# EasyEDA Pro project 键盘.eprj, board PCB1
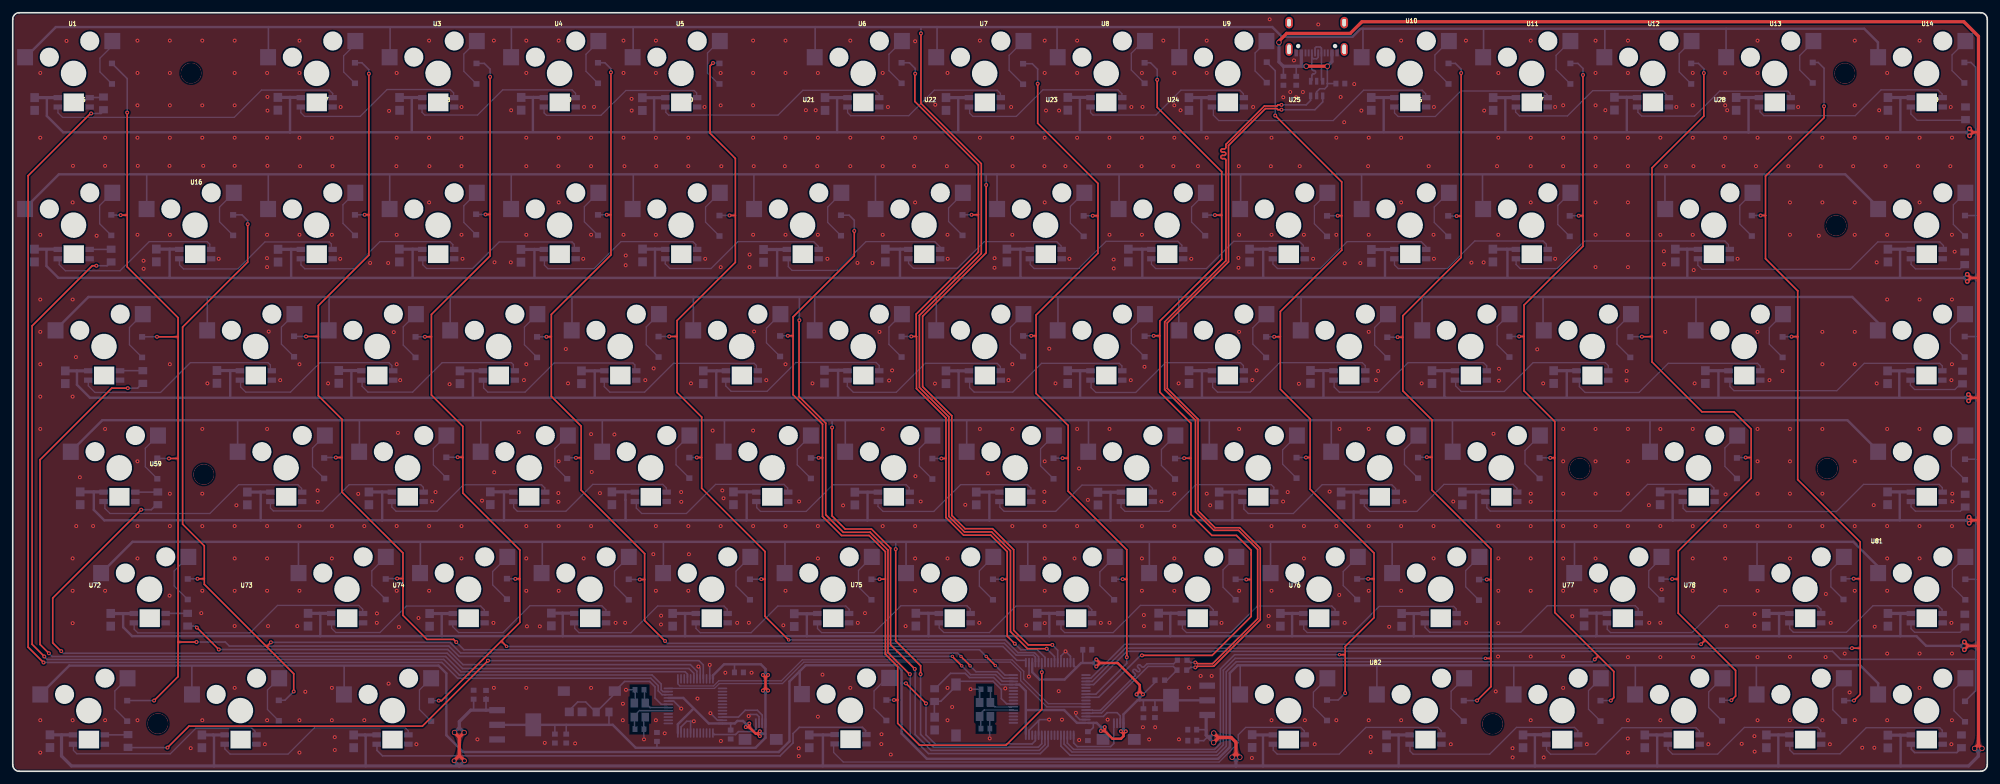
[diagram p3: board, top side]
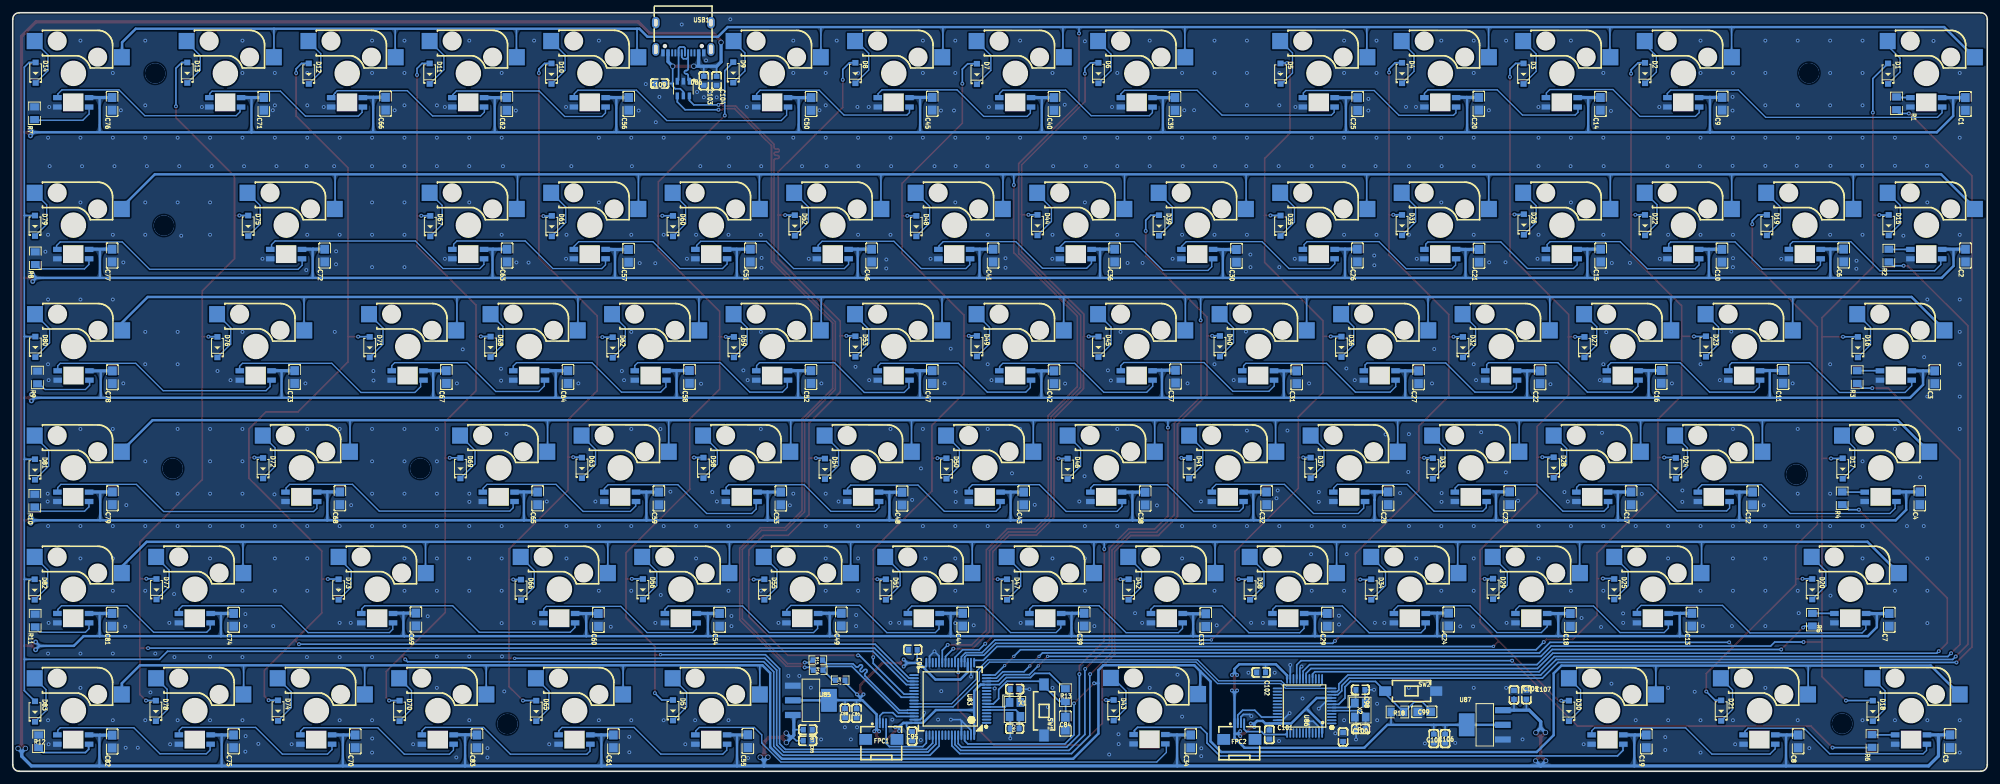
[diagram p4: board, bottom side, seen from below]

Outline 309.56 x 119.06 mm; copper layers: Top Layer, Bottom Layer. Coordinates in mm from the lower left corner of the outline.
Outline path: 0,118.06 0,1 arc(0.29,0.29) 1,0 308.56,0 arc(309.27,0.29) 309.56,1 309.56,118.06 arc(309.27,118.77) 308.56,119.06 1,119.06 arc(0.29,118.77) 0,118.06
Stack: Top Layer 0.035mm / Dielectric1 1.51mm FR4 er 4.5 / Bottom Layer 0.035mm

## Design rules (mm)
net PA11: DP1
net PA12: DP1
net DP_IN: DP2
net DN_OUT: DP3
net DP_OUT: DP3
net DN_IN: DP2
template: 自定义配置
spacing copperThickness1oz (default): track to track 0.102, other pairs 0.152 to 0.3
spacing copperThickness2oz: track to track 0.203, other pairs 0.152 to 0.3
track width copperThickness1oz (default): min 0.127, default 0.254, max 2.54
track width copperThickness2oz: min 0.203, default 0.254, max 2.54
differential pair differentialPair (default): width min 0.127, default 0.254, max 2.54; gap min 0.152, default 0.152
via viaSize (default): diameter min 0.5, default 0.61, max 10; hole min 0.254, default 0.305, max 6.3

## Placement (name value [footprint] x y rotation side)
C1  100nF  [C0805]  3.43 104.74 90 bottom
C2  100nF  [C0805]  3.41 80.95 90 bottom
C3  100nF  [C0805]  8.24 61.85 90 bottom
C4  100nF  [C0805]  10.57 42.85 90 bottom
C5  100nF  [C0805]  5.83 4.72 90 bottom
C6  100nF  [C0805]  22.51 80.96 90 bottom
C7  100nF  [C0805]  15.36 23.77 90 bottom
C8  100nF  [C0805]  29.65 4.7 90 bottom
C9  100nF  [C0805]  41.56 104.77 90 bottom
C10  100nF  [C0805]  41.59 80.93 90 bottom
C11  100nF  [C0805]  32.01 61.9 90 bottom
C12  100nF  [C0805]  36.78 42.82 90 bottom
C13  100nF  [C0805]  46.3 23.79 90 bottom
C14  100nF  [C0805]  60.64 104.76 90 bottom
C15  100nF  [C0805]  60.61 80.95 90 bottom
C16  100nF  [C0805]  51.11 61.9 90 bottom
C17  100nF  [C0805]  55.84 42.84 90 bottom
C18  100nF  [C0805]  65.35 23.76 90 bottom
C19  100nF  [C0805]  53.45 4.7 90 bottom
C20  100nF  [C0805]  79.71 104.77 90 bottom
C21  100nF  [C0805]  79.68 80.91 90 bottom
C22  100nF  [C0805]  70.11 61.85 90 bottom
C23  100nF  [C0805]  74.87 42.86 90 bottom
C24  100nF  [C0805]  84.44 23.82 90 bottom
C25  100nF  [C0805]  98.71 104.72 90 bottom
C26  100nF  [C0805]  98.75 80.96 90 bottom
C27  100nF  [C0805]  89.16 61.85 90 bottom
C28  100nF  [C0805]  93.94 42.85 90 bottom
C29  100nF  [C0805]  103.45 23.77 90 bottom
C30  100nF  [C0805]  117.71 80.9 90 bottom
C31  100nF  [C0805]  108.26 61.85 90 bottom
C32  100nF  [C0805]  112.99 42.85 90 bottom
C33  100nF  [C0805]  122.52 23.72 90 bottom
C34  100nF  [C0805]  124.88 4.7 90 bottom
C35  100nF  [C0805]  127.35 104.74 90 bottom
C36  100nF  [C0805]  136.81 80.95 90 bottom
C37  100nF  [C0805]  127.26 61.95 90 bottom
C38  100nF  [C0805]  132.02 42.81 90 bottom
C39  100nF  [C0805]  141.59 23.8 90 bottom
C40  100nF  [C0805]  146.32 104.74 90 bottom
C41  100nF  [C0805]  155.86 80.95 90 bottom
C42  100nF  [C0805]  146.31 61.85 90 bottom
C43  100nF  [C0805]  151.06 42.82 90 bottom
C44  100nF  [C0805]  160.62 23.79 90 bottom
C45  100nF  [C0805]  165.41 104.77 90 bottom
C46  100nF  [C0805]  174.91 80.95 90 bottom
C47  100nF  [C0805]  165.4 61.88 90 bottom
C48  100nF  [C0805]  170.14 42.8 90 bottom
C49  100nF  [C0805]  179.66 23.81 90 bottom
C50  100nF  [C0805]  184.4 104.74 90 bottom
C51  100nF  [C0805]  193.91 80.95 90 bottom
C52  100nF  [C0805]  184.42 61.88 90 bottom
C53  100nF  [C0805]  189.14 42.82 90 bottom
C54  100nF  [C0805]  198.74 23.77 90 bottom
C55  100nF  [C0805]  194.31 4.73 90 bottom
C56  100nF  [C0805]  212.99 104.76 90 bottom
C57  100nF  [C0805]  213.01 80.9 90 bottom
C58  100nF  [C0805]  203.46 61.9 90 bottom
C59  100nF  [C0805]  208.26 42.82 90 bottom
C60  100nF  [C0805]  217.74 23.76 90 bottom
C61  100nF  [C0805]  215.39 4.7 90 bottom
C62  100nF  [C0805]  232.1 104.74 90 bottom
C63  100nF  [C0805]  232.06 80.95 90 bottom
C64  100nF  [C0805]  222.51 61.88 90 bottom
C65  100nF  [C0805]  227.27 42.84 90 bottom
C66  100nF  [C0805]  251.12 104.79 90 bottom
C67  100nF  [C0805]  241.58 61.88 90 bottom
C68  100nF  [C0805]  258.27 42.85 90 bottom
C69  100nF  [C0805]  246.36 23.82 90 bottom
C70  100nF  [C0805]  255.87 4.7 90 bottom
C71  100nF  [C0805]  270.2 104.76 90 bottom
C72  100nF  [C0805]  260.66 80.95 90 bottom
C73  100nF  [C0805]  265.37 61.88 90 bottom
C74  100nF  [C0805]  274.92 23.77 90 bottom
C75  100nF  [C0805]  274.94 4.7 90 bottom
C76  100nF  [C0805]  293.99 104.76 90 bottom
C77  100nF  [C0805]  293.99 80.95 90 bottom
C78  100nF  [C0805]  293.94 61.85 90 bottom
C79  100nF  [C0805]  293.94 42.85 90 bottom
C81  100nF  [C0805]  293.99 23.77 90 bottom
C82  100nF  [C0805]  293.98 4.67 90 bottom
C83  100nF  [C0805]  236.79 4.7 90 bottom
C84  100nF  [C0805]  144.53 7.48 90 bottom
C85  10uF  [C0603]  184.93 4.8 0 bottom
C86  10uF  [C0603]  177.27 9.11 90 bottom
C87  100nF  [C0603]  184.92 6.53 0 bottom
C88  100nF  [C0603]  179.08 9.13 90 bottom
C93  22pF  [C0603]  152.48 6.71 180 bottom
C94  22pF  [C0603]  152.48 12.9 0 bottom
C95  100nF  [C0603]  168.56 5.51 270 bottom
C96  100nF  [C0603]  168.46 19.07 0 bottom
C97  22pF  [C0603]  98.25 6.63 180 bottom
C98  22pF  [C0603]  98.28 12.78 0 bottom
C99  100nF  [C0805]  88.26 9.32 180 bottom
C100  100nF  [C0603]  101 5.38 90 bottom
C101  100nF  [C0603]  112.55 5.76 270 bottom
C102  100nF  [C0603]  113.85 15.52 0 bottom
C103  10uF  [C0603]  201.23 108.38 90 bottom
C104  100nF  [C0603]  199.22 108.38 90 bottom
C105  10uF  [C0603]  74.2 11.99 270 bottom
C106  10uF  [C0603]  85 5.13 90 bottom
C107  100nF  [C0603]  72.26 12.01 270 bottom
C108  100nF  [C0603]  86.77 5.13 90 bottom
C109  100nF  [C0603]  208.14 107.95 180 bottom
D1  1N4148W  [SOD-123_L2.7-W1.6-LS3.7-FD]  15.55 109.5 270 bottom
D2  1N4148W  [SOD-123_L2.7-W1.6-LS3.7-FD]  53.65 109.6 270 bottom
D3  1N4148W  [SOD-123_L2.7-W1.6-LS3.7-FD]  72.7 109.5 270 bottom
D4  1N4148W  [SOD-123_L2.7-W1.6-LS3.7-FD]  91.75 109.6 270 bottom
D5  1N4148W  [SOD-123_L2.7-W1.6-LS3.7-FD]  110.8 109.5 270 bottom
D6  1N4148W  [SOD-123_L2.7-W1.6-LS3.7-FD]  139.35 109.6 270 bottom
D7  1N4148W  [SOD-123_L2.7-W1.6-LS3.7-FD]  158.4 109.45 270 bottom
D8  1N4148W  [SOD-123_L2.7-W1.6-LS3.7-FD]  177.45 109.6 270 bottom
D9  1N4148W  [SOD-123_L2.7-W1.6-LS3.7-FD]  196.6 109.7 270 bottom
D10  1N4148W  [SOD-123_L2.7-W1.6-LS3.7-FD]  225.1 109.5 270 bottom
D11  1N4148W  [SOD-123_L2.7-W1.6-LS3.7-FD]  244.2 109.5 270 bottom
D12  1N4148W  [SOD-123_L2.7-W1.6-LS3.7-FD]  263.15 109.5 270 bottom
D13  1N4148W  [SOD-123_L2.7-W1.6-LS3.7-FD]  282.2 109.65 270 bottom
D14  1N4148W  [SOD-123_L2.7-W1.6-LS3.7-FD]  305.97 109.65 270 bottom
D15  1N4148W  [SOD-123_L2.7-W1.6-LS3.7-FD]  15.45 85.72 270 bottom
D16  1N4148W  [SOD-123_L2.7-W1.6-LS3.7-FD]  20.28 66.57 270 bottom
D17  1N4148W  [SOD-123_L2.7-W1.6-LS3.7-FD]  22.66 47.52 270 bottom
D18  1N4148W  [SOD-123_L2.7-W1.6-LS3.7-FD]  17.94 9.47 270 bottom
D19  1N4148W  [SOD-123_L2.7-W1.6-LS3.7-FD]  34.55 85.72 270 bottom
D20  1N4148W  [SOD-123_L2.7-W1.6-LS3.7-FD]  27.44 28.57 270 bottom
D21  1N4148W  [SOD-123_L2.7-W1.6-LS3.7-FD]  41.71 9.52 270 bottom
D22  1N4148W  [SOD-123_L2.7-W1.6-LS3.7-FD]  53.65 85.72 270 bottom
D23  1N4148W  [SOD-123_L2.7-W1.6-LS3.7-FD]  44.1 66.67 270 bottom
D24  1N4148W  [SOD-123_L2.7-W1.6-LS3.7-FD]  48.83 47.57 270 bottom
D25  1N4148W  [SOD-123_L2.7-W1.6-LS3.7-FD]  58.48 28.57 270 bottom
D26  1N4148W  [SOD-123_L2.7-W1.6-LS3.7-FD]  72.65 85.83 270 bottom
D27  1N4148W  [SOD-123_L2.7-W1.6-LS3.7-FD]  63.15 66.57 270 bottom
D28  1N4148W  [SOD-123_L2.7-W1.6-LS3.7-FD]  67.98 47.67 270 bottom
D29  1N4148W  [SOD-123_L2.7-W1.6-LS3.7-FD]  77.48 28.62 270 bottom
D30  1N4148W  [SOD-123_L2.7-W1.6-LS3.7-FD]  65.59 9.47 270 bottom
D31  1N4148W  [SOD-123_L2.7-W1.6-LS3.7-FD]  91.75 85.72 270 bottom
D32  1N4148W  [SOD-123_L2.7-W1.6-LS3.7-FD]  82.2 66.57 270 bottom
D33  1N4148W  [SOD-123_L2.7-W1.6-LS3.7-FD]  86.93 47.52 270 bottom
D34  1N4148W  [SOD-123_L2.7-W1.6-LS3.7-FD]  96.58 28.52 270 bottom
D35  1N4148W  [SOD-123_L2.7-W1.6-LS3.7-FD]  110.8 85.62 270 bottom
D36  1N4148W  [SOD-123_L2.7-W1.6-LS3.7-FD]  101.25 66.62 270 bottom
D37  1N4148W  [SOD-123_L2.7-W1.6-LS3.7-FD]  106.08 47.62 270 bottom
D38  1N4148W  [SOD-123_L2.7-W1.6-LS3.7-FD]  115.58 28.52 270 bottom
D39  1N4148W  [SOD-123_L2.7-W1.6-LS3.7-FD]  129.85 85.67 270 bottom
D40  1N4148W  [SOD-123_L2.7-W1.6-LS3.7-FD]  120.3 66.72 270 bottom
D41  1N4148W  [SOD-123_L2.7-W1.6-LS3.7-FD]  125.13 47.57 270 bottom
D42  1N4148W  [SOD-123_L2.7-W1.6-LS3.7-FD]  134.63 28.52 270 bottom
D43  1N4148W  [SOD-123_L2.7-W1.6-LS3.7-FD]  136.96 9.57 270 bottom
D44  1N4148W  [SOD-123_L2.7-W1.6-LS3.7-FD]  148.9 85.72 270 bottom
D45  1N4148W  [SOD-123_L2.7-W1.6-LS3.7-FD]  139.35 66.62 270 bottom
D46  1N4148W  [SOD-123_L2.7-W1.6-LS3.7-FD]  144.18 47.47 270 bottom
D47  1N4148W  [SOD-123_L2.7-W1.6-LS3.7-FD]  153.68 28.52 270 bottom
D48  1N4148W  [SOD-123_L2.7-W1.6-LS3.7-FD]  167.9 85.57 270 bottom
D49  1N4148W  [SOD-123_L2.7-W1.6-LS3.7-FD]  158.4 66.72 270 bottom
D50  1N4148W  [SOD-123_L2.7-W1.6-LS3.7-FD]  163.18 47.52 270 bottom
D51  1N4148W  [SOD-123_L2.7-W1.6-LS3.7-FD]  172.68 28.52 270 bottom
D52  1N4148W  [SOD-123_L2.7-W1.6-LS3.7-FD]  186.95 85.67 270 bottom
D53  1N4148W  [SOD-123_L2.7-W1.6-LS3.7-FD]  177.45 66.67 270 bottom
D54  1N4148W  [SOD-123_L2.7-W1.6-LS3.7-FD]  182.23 47.47 270 bottom
D55  1N4148W  [SOD-123_L2.7-W1.6-LS3.7-FD]  191.73 28.52 270 bottom
D56  1N4148W  [SOD-123_L2.7-W1.6-LS3.7-FD]  210.78 28.57 270 bottom
D57  1N4148W  [SOD-123_L2.7-W1.6-LS3.7-FD]  206.05 9.57 270 bottom
D58  1N4148W  [SOD-123_L2.7-W1.6-LS3.7-FD]  201.28 47.62 270 bottom
D59  1N4148W  [SOD-123_L2.7-W1.6-LS3.7-FD]  196.5 66.57 270 bottom
D60  1N4148W  [SOD-123_L2.7-W1.6-LS3.7-FD]  206.05 85.57 270 bottom
D61  1N4148W  [SOD-123_L2.7-W1.6-LS3.7-FD]  225.05 85.57 270 bottom
D62  1N4148W  [SOD-123_L2.7-W1.6-LS3.7-FD]  215.5 66.52 270 bottom
D63  1N4148W  [SOD-123_L2.7-W1.6-LS3.7-FD]  220.33 47.62 270 bottom
D65  1N4148W  [SOD-123_L2.7-W1.6-LS3.7-FD]  227.49 9.47 270 bottom
D66  1N4148W  [SOD-123_L2.7-W1.6-LS3.7-FD]  229.88 28.47 270 bottom
D67  1N4148W  [SOD-123_L2.7-W1.6-LS3.7-FD]  244.1 85.57 270 bottom
D68  1N4148W  [SOD-123_L2.7-W1.6-LS3.7-FD]  234.65 66.62 270 bottom
D69  1N4148W  [SOD-123_L2.7-W1.6-LS3.7-FD]  239.38 47.57 270 bottom
D70  1N4148W  [SOD-123_L2.7-W1.6-LS3.7-FD]  248.93 9.47 270 bottom
D71  1N4148W  [SOD-123_L2.7-W1.6-LS3.7-FD]  253.6 66.57 270 bottom
D72  1N4148W  [SOD-123_L2.7-W1.6-LS3.7-FD]  270.31 47.57 270 bottom
D73  1N4148W  [SOD-123_L2.7-W1.6-LS3.7-FD]  258.48 28.52 270 bottom
D74  1N4148W  [SOD-123_L2.7-W1.6-LS3.7-FD]  267.98 9.52 270 bottom
D75  1N4148W  [SOD-123_L2.7-W1.6-LS3.7-FD]  272.65 85.62 270 bottom
D76  1N4148W  [SOD-123_L2.7-W1.6-LS3.7-FD]  277.48 66.57 270 bottom
D77  1N4148W  [SOD-123_L2.7-W1.6-LS3.7-FD]  287.03 28.57 270 bottom
D78  1N4148W  [SOD-123_L2.7-W1.6-LS3.7-FD]  287.13 9.47 270 bottom
D79  1N4148W  [SOD-123_L2.7-W1.6-LS3.7-FD]  306.08 85.62 270 bottom
D80  1N4148W  [SOD-123_L2.7-W1.6-LS3.7-FD]  306.03 66.62 270 bottom
D81  1N4148W  [SOD-123_L2.7-W1.6-LS3.7-FD]  306.08 47.37 270 bottom
D82  1N4148W  [SOD-123_L2.7-W1.6-LS3.7-FD]  306.13 28.52 270 bottom
D83  1N4148W  [SOD-123_L2.7-W1.6-LS3.7-FD]  306.08 9.37 270 bottom
D86  USBLC6-2SC6  [SOT-23-6_L2.9-W1.6-P0.95-LS2.8-BL]  204.43 107.16 0 bottom
FPC1  XW05202-040R-00  [FPC-SMD_4P-P0.50_HCTL_XW05202-040R-00]  173.39 6.27 180 bottom
FPC2  XW05202-040R-00  [FPC-SMD_4P-P0.50_HCTL_XW05202-040R-00]  117.25 6.27 180 bottom
R1  500Ω  [R0805]  14.22 104.84 90 bottom
R2  500Ω  [R0805]  15.43 80.94 90 bottom
R3  500Ω  [R0805]  20.39 61.88 90 bottom
R4  500Ω  [R0805]  22.74 42.84 90 bottom
R5  500Ω  [R0805]  27.41 23.79 90 bottom
R6  500Ω  [R0805]  18.07 4.75 90 bottom
R7  500Ω  [R0805]  306.15 103.28 90 bottom
R8  500Ω  [R0805]  306.03 80.52 90 bottom
R9  500Ω  [R0805]  305.69 61.81 90 bottom
R10  500Ω  [R0805]  306.11 42.48 90 bottom
R11  500Ω  [R0805]  306.05 23.65 90 bottom
R12  500Ω  [R0805]  305.52 4.7 90 bottom
R13  10kΩ  [R0805]  144.53 11.95 90 bottom
R15  22Ω  [R0603]  183.34 17.45 180 bottom
R16  22Ω  [R0603]  183.29 15.87 180 bottom
R17  1.5kΩ  [R0603]  179.84 14.3 180 bottom
R18  10kΩ  [R0805]  92.47 9.3 0 bottom
SW1  TS-1101-C-W  [SW-SMD_L6.0-W3.3-LS8.0]  147.88 9.62 90 bottom
SW2  TS-1101-C-W  [SW-SMD_L6.0-W3.3-LS8.0]  90.4 12.58 0 bottom
U1  -  [凯华rgb轴座5脚]  9.56 109.55 0 top
U2  -  [凯华rgb轴座5脚]  47.66 109.55 0 top
U3  -  [凯华rgb轴座5脚]  66.71 109.55 0 top
U4  -  [凯华rgb轴座5脚]  85.76 109.55 0 top
U5  -  [凯华rgb轴座5脚]  104.81 109.55 0 top
U6  -  [凯华rgb轴座5脚]  133.36 109.55 0 top
U7  -  [凯华rgb轴座5脚]  152.41 109.55 0 top
U8  -  [凯华rgb轴座5脚]  171.46 109.55 0 top
U9  -  [凯华rgb轴座5脚]  190.51 109.55 0 top
U10  -  [凯华rgb轴座5脚]  219.11 109.55 0 top
U11  -  [凯华rgb轴座5脚]  238.16 109.55 0 top
U12  -  [凯华rgb轴座5脚]  257.16 109.55 0 top
U13  -  [凯华rgb轴座5脚]  276.26 109.55 0 top
U14  -  [凯华rgb轴座5脚]  300.08 109.55 0 top
U15  -  [凯华rgb轴座5脚]  9.56 85.72 0 top
U16  -  [凯华rgb轴座5脚]  28.61 85.72 0 top
U17  -  [凯华rgb轴座5脚]  47.66 85.72 0 top
U18  -  [凯华rgb轴座5脚]  66.71 85.72 0 top
U19  -  [凯华rgb轴座5脚]  85.76 85.72 0 top
U20  -  [凯华rgb轴座5脚]  104.81 85.72 0 top
U21  -  [凯华rgb轴座5脚]  123.86 85.72 0 top
U22  -  [凯华rgb轴座5脚]  142.91 85.72 0 top
U23  -  [凯华rgb轴座5脚]  161.96 85.72 0 top
U24  -  [凯华rgb轴座5脚]  181.01 85.72 0 top
U25  -  [凯华rgb轴座5脚]  200.06 85.72 0 top
U26  -  [凯华rgb轴座5脚]  219.11 85.72 0 top
U27  -  [凯华rgb轴座5脚]  238.16 85.72 0 top
U28  -  [凯华rgb轴座5脚]  266.71 85.72 0 top
U29  -  [凯华rgb轴座5脚]  300.08 85.72 0 top
U30  -  [凯华rgb轴座5脚]  14.33 66.67 0 top
U31  -  [凯华rgb轴座5脚]  38.11 66.67 0 top
U32  -  [凯华rgb轴座5脚]  57.16 66.67 0 top
U33  -  [凯华rgb轴座5脚]  76.21 66.67 0 top
U34  -  [凯华rgb轴座5脚]  95.26 66.67 0 top
U35  -  [凯华rgb轴座5脚]  114.31 66.67 0 top
U36  -  [凯华rgb轴座5脚]  133.36 66.67 0 top
U37  -  [凯华rgb轴座5脚]  152.41 66.67 0 top
U38  -  [凯华rgb轴座5脚]  171.46 66.67 0 top
U39  -  [凯华rgb轴座5脚]  190.51 66.67 0 top
U40  -  [凯华rgb轴座5脚]  209.56 66.67 0 top
U41  -  [凯华rgb轴座5脚]  228.61 66.67 0 top
U42  -  [凯华rgb轴座5脚]  247.66 66.67 0 top
U43  -  [凯华rgb轴座5脚]  271.48 66.67 0 top
U44  -  [凯华rgb轴座5脚]  300.03 66.67 0 top
U45  -  [凯华rgb轴座5脚]  16.72 47.62 0 top
U46  -  [凯华rgb轴座5脚]  42.88 47.62 0 top
U47  -  [凯华rgb轴座5脚]  61.93 47.62 0 top
U48  -  [凯华rgb轴座5脚]  80.98 47.62 0 top
U49  -  [凯华rgb轴座5脚]  100.03 47.62 0 top
U50  -  [凯华rgb轴座5脚]  119.08 47.62 0 top
U51  -  [凯华rgb轴座5脚]  138.13 47.62 0 top
U52  -  [凯华rgb轴座5脚]  157.18 47.62 0 top
U53  -  [凯华rgb轴座5脚]  176.23 47.62 0 top
U54  -  [凯华rgb轴座5脚]  195.28 47.62 0 top
U55  -  [凯华rgb轴座5脚]  214.33 47.62 0 top
U56  -  [凯华rgb轴座5脚]  233.38 47.62 0 top
U57  -  [凯华rgb轴座5脚]  264.32 47.62 0 top
U58  -  [凯华rgb轴座5脚]  300.08 47.62 0 top
U59  -  [凯华rgb轴座5脚]  21.48 28.58 0 top
U60  -  [凯华rgb轴座5脚]  52.43 28.57 0 top
U61  -  [凯华rgb轴座5脚]  71.48 28.57 0 top
U62  -  [凯华rgb轴座5脚]  90.53 28.57 0 top
U63  -  [凯华rgb轴座5脚]  109.58 28.57 0 top
U64  -  [凯华rgb轴座5脚]  128.63 28.57 0 top
U65  -  [凯华rgb轴座5脚]  147.68 28.57 0 top
U66  -  [凯华rgb轴座5脚]  166.73 28.57 0 top
U67  -  [凯华rgb轴座5脚]  185.78 28.57 0 top
U68  -  [凯华rgb轴座5脚]  204.83 28.57 0 top
U69  -  [凯华rgb轴座5脚]  223.88 28.57 0 top
U70  -  [凯华rgb轴座5脚]  252.43 28.57 0 top
U71  -  [凯华rgb轴座5脚]  281.03 28.57 0 top
U72  -  [凯华rgb轴座5脚]  11.94 9.52 0 top
U73  -  [凯华rgb轴座5脚]  35.72 9.52 0 top
U74  -  [凯华rgb轴座5脚]  59.54 9.52 0 top
U75  -  [凯华rgb轴座5脚]  131.35 9.57 0 top
U76  -  [凯华rgb轴座5脚]  200.06 9.52 0 top
U77  -  [凯华rgb轴座5脚]  242.93 9.52 0 top
U78  -  [凯华rgb轴座5脚]  261.98 9.52 0 top
U79  -  [凯华rgb轴座5脚]  281.03 9.52 0 top
U80  -  [凯华rgb轴座5脚]  300.08 9.52 0 top
U81  -  [凯华rgb轴座5脚]  300.08 28.57 0 top
U82  -  [凯华rgb轴座5脚]  221.49 9.52 0 top
U83  STM32F103RCT6  [LQFP-64_L10.0-W10.0-P0.50-LS12.0-BL]  162.57 11.35 90 bottom
U85  AMS1117-3.3  [SOT-223-4_L6.5-W3.5-P2.30-LS7.0-BR]  184.43 11.13 0 bottom
U86  STM32F103C8T6  [LQFP-48_L7.0-W7.0-P0.50-LS9.0-BL]  107.03 10.26 90 bottom
U87  AMS1117-3.3  [SOT-223-4_L6.5-W3.5-P2.30-LS7.0-BR]  78.77 7.29 180 bottom
USB1  TYPE-C 16PIN 2MD(073)  [USB-C-SMD_TYPE-C-6PIN-2MD-073]  204.43 115.14 0 bottom
X1  8MHz  [CRYSTAL-SMD_4P-L3.2-W2.5-BL]  152.43 9.7 270 bottom
X2  8MHz  [CRYSTAL-SMD_4P-L3.2-W2.5-BL]  98.3 9.6 270 bottom

## Footprints (pads in the part's own frame, mm; a bottom-side part is the same pattern mirrored in y, then rotated)
C0603
  rect 0.8x0.9 smd: 1(-0.7,0) 2(0.7,0)
C0805
  rect 1.41x1.35 smd: 1(-1,0) 2(1,0)
CRYSTAL-SMD_4P-L3.2-W2.5-BL
  rect 1.4x1.2 smd: 1(-1.1,-0.85) 2(1.1,-0.85) 3(1.1,0.85) 4(-1.1,0.85)
FPC-SMD_4P-P0.50_HCTL_XW05202-040R-00
  rect 0.3x1.5 smd: 1(-0.75,1.275) 2(-0.25,1.275) 3(0.25,1.275) 4(0.75,1.275)
  rect 2x1.7 smd: 5(2.45,-1.275) 6(-2.45,-1.275)
LQFP-48_L7.0-W7.0-P0.50-LS9.0-BL
  oval 0.27x1.5 smd: 1(-2.75,-4.25) 2(-2.25,-4.25) 3(-1.75,-4.25) 4(-1.25,-4.25) 5(-0.75,-4.25) 6(-0.25,-4.25) 7(0.25,-4.25) 8(0.75,-4.25) 9(1.25,-4.25) 10(1.75,-4.25) 11(2.25,-4.25) 12(2.75,-4.25) 25(2.75,4.25) 26(2.25,4.25) 27(1.75,4.25) 28(1.25,4.25) 29(0.75,4.25) 30(0.25,4.25) 31(-0.25,4.25) 32(-0.75,4.25) 33(-1.25,4.25) 34(-1.75,4.25) 35(-2.25,4.25) 36(-2.75,4.25)
  oval 1.5x0.27 smd: 13(4.25,-2.75) 14(4.25,-2.25) 15(4.25,-1.75) 16(4.25,-1.25) 17(4.25,-0.75) 18(4.25,-0.25) 19(4.25,0.25) 20(4.25,0.75) 21(4.25,1.25) 22(4.25,1.75) 23(4.25,2.25) 24(4.25,2.75) 37(-4.25,2.75) 38(-4.25,2.25) 39(-4.25,1.75) 40(-4.25,1.25) 41(-4.25,0.75) 42(-4.25,0.25) 43(-4.25,-0.25) 44(-4.25,-0.75) 45(-4.25,-1.25) 46(-4.25,-1.75) 47(-4.25,-2.25) 48(-4.25,-2.75)
LQFP-64_L10.0-W10.0-P0.50-LS12.0-BL
  oval 0.3x1.5 smd: 1(-3.75,-5.688) 2(-3.25,-5.688) 3(-2.75,-5.688) 4(-2.25,-5.688) 5(-1.75,-5.688) 6(-1.25,-5.688) 7(-0.75,-5.688) 8(-0.25,-5.688) 9(0.25,-5.688) 10(0.75,-5.688) 11(1.25,-5.688) 12(1.75,-5.688) 13(2.25,-5.688) 14(2.75,-5.688) 15(3.25,-5.688) 16(3.75,-5.688) 33(3.75,5.688) 34(3.25,5.688) 35(2.75,5.688) 36(2.25,5.688) 37(1.75,5.688) 38(1.25,5.688) 39(0.75,5.688) 40(0.25,5.688) 41(-0.25,5.688) 42(-0.75,5.688) 43(-1.25,5.688) 44(-1.75,5.688) 45(-2.25,5.688) 46(-2.75,5.688) 47(-3.25,5.688) 48(-3.75,5.688)
  oval 1.5x0.3 smd: 17(5.7,-3.738) 18(5.7,-3.238) 19(5.7,-2.738) 20(5.7,-2.238) 21(5.7,-1.738) 22(5.7,-1.238) 23(5.7,-0.739) 24(5.7,-0.238) 25(5.7,0.262) 26(5.7,0.762) 27(5.7,1.262) 28(5.7,1.762) 29(5.7,2.261) 30(5.7,2.762) 31(5.7,3.261) 32(5.7,3.762) 49(-5.7,3.762) 50(-5.7,3.261) 51(-5.7,2.762) 52(-5.7,2.261) 53(-5.7,1.762) 54(-5.7,1.262) 55(-5.7,0.762) 56(-5.7,0.262) 57(-5.7,-0.238) 58(-5.7,-0.739) 59(-5.7,-1.238) 60(-5.7,-1.738) 61(-5.7,-2.238) 62(-5.7,-2.738) 63(-5.7,-3.238) 64(-5.7,-3.738)
R0603
  rect 0.806x0.864 smd: 1(-0.753,0) 2(0.753,0)
R0805
  rect 1.133x1.377 smd: 1(-1,0) 2(1,0)
SOD-123_L2.7-W1.6-LS3.7-FD
  rect 0.88x0.96 smd: 1(-1.61,0) 2(1.61,0)
SOT-23-6_L2.9-W1.6-P0.95-LS2.8-BL
  rect 0.532x1.072 smd: 1(-0.95,-1.149) 2(0,-1.149) 3(0.95,-1.149) 4(0.95,1.149) 5(0,1.149) 6(-0.95,1.149)
SOT-223-4_L6.5-W3.5-P2.30-LS7.0-BR
  rect 2.47x0.98 smd: 1(2.835,-2.3) 2(2.835,0) 3(2.835,2.3)
  rect 2.47x3.6 smd: 4(-2.835,0)
SW-SMD_L6.0-W3.3-LS8.0
  rect 1.9x1.5 smd: 1(-4,0) 2(4,0)
USB-C-SMD_TYPE-C-6PIN-2MD-073
  rect 0.55x1.1 smd: 1(-3.2,2.375) 2(-2.4,2.375) 11(2.4,2.375) 12(3.2,2.375)
  rect 0.3x1.1 smd: 3(-1.75,2.375) 4(-1.25,2.375) 5(-0.75,2.375) 6(-0.25,2.375) 7(0.25,2.375) 8(0.75,2.375) 9(1.25,2.375) 10(1.75,2.375)
  oval 1.2x1.8 hole 0.6x1.2: 13(-4.325,-2.375) 14(4.325,-2.375)
  oval 1.1x2 hole 0.6x1.5: 13(-4.325,1.825) 14(4.325,1.825)
凯华rgb轴座5脚
  rect 2.5x2.55 smd far side: 1(-7.626,2.531) 2(6.048,5.071)
  custom 1.34x0.82 smd far side: 3(-2.489,-3.81) 4(2.489,-3.81) 5(-2.489,-5.283) 6(2.489,-5.283)

## Nets
As in the schematic.

Pads without a net: FPC1 5 6; FPC2 5 6; U83 1 2 3 4 8 9 10 11 24 25 29 30 33 37 38 41 50 54 55 56 62; U86 1 2 3 4 14 15 17 22 25 26 27 28 29 30 31 32 33 38 39 40 41 42 43 45 46; USB1 3 4 9 10 13 14

## Via types
v1: diameter 3.2, hole 3.2, Top Layer to Bottom Layer, 8 vias
v2: diameter 0.61, hole 0.305, Top Layer to Bottom Layer, 876 vias
v3: diameter 0.762, hole 0.381, Top Layer to Bottom Layer, 10 vias
v4: diameter 0.762, hole 0.508, Top Layer to Bottom Layer, 2 vias
v5: diameter 0.838, hole 0.61, Top Layer to Bottom Layer, 11 vias
v6: diameter 0.508, hole 0.254, Top Layer to Bottom Layer, 10 vias

## Routing (per net, layer and track width the routed paths; a pad name or vN(x,y) marks a point on that pad's centre or on a via; arc(x,y) is an arc through that point)
3V3_1: length 98
  Top Layer w0.381: 174.15,5.87 174.15,5.92 v2(174.5,6.27) ; 174.15,5.87 v2(173.74,6.27) ; 174.15,5.87 174.15,5.51 173.74,5.1 172.42,5.1 171.21,6.32 ; 171.21,6.32 v2(171.21,6.93) ; 171.21,6.32 v2(170.59,6.32) ; 170.44,16.99 v2(169.88,17.55) ; 170.44,16.99 v2(169.88,16.43) ; 170.44,16.99 173.23,16.99 176.69,13.54 176.69,12.57 ; v2(177.2,12.06) 176.69,12.57 ; 176.69,12.57 v2(176.18,12.06)
  Bottom Layer w0.254: 166.71,16.21 166.33,16.58 U83.32 ; R17.2 179.09,13.95 v2(177.2,12.06) ; 156.81,13.6 154.89,13.6 153.79,14.71 150,14.71 149.34,15.37 147.02,15.37 144.61,12.96 ; 177.25,11.14 177.27,11.12 177.27,9.8 ; 179.07,9.84 179.07,11.13 179.09,11.15 ; 167.76,19.2 167.76,17.03 ; 168.43,6.21 168.75,6.21 169.41,6.87 169.41,7.59
  Bottom Layer w0.381: 176.69,11.16 176.36,11.16 174.14,8.93 FPC1.1 174.14,6.67 174.13,6.66 174.13,6.66 ; 176.69,11.16 181.44,11.16 181.51,11.22 ; 176.69,11.16 176.69,11.56 ; 168.18,7.6 166.85,7.6 164.84,9.61 159.01,9.61 ; 170.59,6.95 169.95,7.59 168.58,7.59 ; 170.59,6.95 v2(170.59,6.32) ; 170.59,6.95 170.61,6.93 v2(171.21,6.93) ; v2(174.5,6.27) 174.5,6.28 174.13,6.66 ; 169.32,16.99 167.49,16.99 166.71,16.21 164.9,14.4 160.99,14.4 159.83,15.56 U83.19 ; 169.32,16.99 v2(169.88,16.43) ; 169.32,16.99 v2(169.88,17.55) ; 158.82,5.86 158.82,12.6 157.82,13.6 157.29,13.6 ; 174.13,6.66 173.93,6.46 ; 173.93,6.46 v2(173.74,6.27) ; 176.69,11.56 v2(176.18,12.06) ; 176.69,11.56 v2(177.2,12.06) ; 187.25,11.13 181.83,11.13
3V3_2: length 100
  Top Layer w0.381: 115.48,6.91 115.45,6.93 v2(114.92,6.93) ; 115.48,6.91 116.49,5.9 116.75,5.9 ; 115.48,6.91 v2(115.48,7.49) ; v2(118.42,15.11) 118.02,14.71 ; 118.02,14.71 v2(117.61,15.11) ; 118.02,14.71 118.02,13.08 ; 116.75,5.9 v2(117.13,6.27) ; 116.75,5.9 116.75,5.89 v2(117.13,5.51) ; v2(118.42,12.67) 118.02,13.08 ; 118.02,13.08 v2(117.61,12.67)
  Bottom Layer w0.254: C106.2 85,7.26 ; R18.2 93.47,7.29 ; 112.55,7.51 112.55,6.21 ; C102.1 113.16,15.53 113.16,16.79 ; C100.1 101,3.69 ; C108.2 86.77,7.29
  Bottom Layer w0.381: 106.71,9.82 104.28,7.38 U86.48 ; U86.24 109.78,15.04 111.52,16.79 117.28,16.79 118.02,16.06 118.02,15.52 ; 102.81,11.51 105.12,11.51 109.12,7.51 U86.36 113.2,7.51 113.6,7.9 114.48,7.9 114.89,7.49 v2(115.48,7.49) ; v2(114.92,6.93) 114.92,7.47 ; 118.02,12.27 118.02,5.26 116.44,3.68 97.67,3.68 94.06,7.29 82.24,7.29 ; 118.02,12.27 v2(117.61,12.67) ; 118.02,12.27 v2(118.42,12.67) ; 118.02,15.52 v2(117.61,15.11) ; 118.02,15.52 v2(118.42,15.11) ; 117.51,5.89 117.97,5.89 ; 117.51,5.89 v2(117.13,5.51) ; 117.51,5.89 v2(117.13,6.27) ; 77.08,7.29 77.09,7.28 81.61,7.28
+5V: length 2775
  Top Layer w0.381: 306.59,19.69 306.58,19.69 v3(305.97,20.29) ; 306.59,19.69 v3(305.97,19.07) ; 306.59,19.69 308.16,19.69 308.19,19.67 ; 307.2,39.39 306.75,38.94 v3(306.74,38.94) ; 307.2,39.39 308.15,39.39 308.19,39.43 ; 307.2,39.39 v3(306.72,39.88) ; v3(306.43,78) 306.99,77.44 ; 306.99,77.44 v3(306.43,76.88) ; 306.99,77.44 308.17,77.44 308.19,77.46 ; v3(306.62,59.14) 307.12,58.63 ; 307.12,58.63 306.64,58.14 ; 307.12,58.63 308.18,58.63 308.19,58.63 ; v3(306.79,99.75) 306.79,99.75 307.35,100.3 ; v3(306.78,100.86) 307.35,100.3 ; 307.35,100.3 308.15,100.3 308.19,100.33
  Top Layer w0.508: v5(307.57,3.58) 308.19,4.19 308.19,115.37 305.9,117.65 211.52,117.65 209.69,115.82 199.72,115.82 198.51,114.61 v5(198.51,114.41) ; v5(192.39,2.21) 191.78,2.82 ; 191.78,2.82 191.78,4.55 191.01,5.31 189.08,5.31 v5(188.27,4.5) ; 191.78,2.82 v5(191.17,2.21) ; 70.01,5.33 70.75,6.07 v5(70.77,6.07) ; 70.01,5.33 70.01,2.46 ; 70.01,5.33 v5(69.26,6.08) ; v5(206.1,110.67) v5(202.8,110.67) ; 188.98,5.31 v5(188.3,5.99) ; 70.01,2.46 v4(70.82,1.65) ; 70.01,2.46 v4(69.2,1.65) ; v5(308.74,3.58) 308.19,4.14
  Bottom Layer w0.203: 7.27,81.95 7.29,81.93
  Bottom Layer w0.254: 201.26,110.67 201.23,110.63 C103.2 ; 199.22,109.08 199.22,110.56 ; C109.2 206.12,107.95 206.1,107.97 ; C85.2 186.73,4.8 187.35,5.42 ; 74.2,9.59 C105.2 74.2,11.7 ; 187.1,6.42 187,6.53 C87.2 ; C107.2 72.26,9.62 ; D86.5 204.43,106.65 204.9,107.13 205.69,107.13 206.1,107.54 206.1,107.97 ; 206.1,107.97 v5(206.1,110.67)
  Bottom Layer w0.381: 191.21,39.39 191.22,39.4 191.22,43.81 191.2,43.82 ; 191.21,39.39 172.13,39.39 ; 191.21,39.39 210.21,39.39 ; 305.87,77.44 v3(306.43,76.88) ; 305.87,77.44 v3(306.43,78) ; 305.87,77.44 262.56,77.44 ; 100.55,100.34 100.55,105.68 100.51,105.72 ; 295.95,100.34 295.95,105.59 295.88,105.66 ; 62.69,77.44 81.73,77.44 ; 62.69,77.44 62.69,77.45 62.69,81.95 ; 62.69,77.44 43.68,77.44 ; 81.73,77.44 81.79,77.51 81.79,81.9 81.78,81.91 ; 81.73,77.44 100.72,77.44 ; 219.57,24.76 219.66,24.68 219.66,21.21 ; 126.96,0.84 127.02,0.89 127.02,5.7 ; 153.12,39.39 172.13,39.39 ; 153.12,39.39 153.12,39.4 153.12,43.82 153.11,43.82 ; 153.12,39.39 133.98,39.39 ; 172.13,39.39 172.12,39.41 172.12,43.8 172.12,43.8 ; 86.23,21.21 105.41,21.21 ; 86.23,21.21 86.23,24.76 86.17,24.82 ; 86.23,21.21 67.25,21.21 ; 105.41,21.21 124.5,21.21 ; 105.41,21.21 105.41,24.7 105.34,24.77 ; 24.55,77.44 24.53,77.44 ; 24.53,77.44 7.15,77.44 5.29,79.3 5.29,81.78 5.36,81.85 ; 24.53,77.44 24.59,77.51 24.59,81.96 24.6,81.96 ; 38.87,39.39 14.35,39.39 12.71,41.03 12.71,43.84 12.69,43.85 ; 38.87,39.39 57.91,39.39 ; 38.87,39.4 38.87,43.79 38.84,43.82 ; 243.62,58.63 224.63,58.63 ; 243.62,58.63 267.43,58.63 ; 243.62,58.63 243.64,58.65 243.64,62.88 ; 224.63,58.63 224.44,58.82 224.44,62.88 ; 224.63,58.63 205.47,58.63 ; v3(306.74,38.94) 306.69,38.94 306.23,39.39 ; 96.05,43.85 96.05,42.61 96.07,42.59 96.07,39.51 96.18,39.39 ; 148.18,105.7 148.23,105.64 148.23,100.37 ; 186.43,58.63 186.44,58.64 186.44,62.82 186.5,62.88 ; 186.43,58.63 167.35,58.63 ; 186.43,58.63 205.47,58.63 ; 43.47,100.3 43.47,105.84 ; 43.47,100.3 272.14,100.3 ; 43.47,100.3 43.47,100.28 ; 43.47,100.3 7.9,100.3 5.34,102.86 5.34,105.65 5.31,105.68 ; 53.13,58.63 34.09,58.63 ; 53.13,58.63 53.09,58.67 53.09,62.85 53.14,62.9 ; 53.13,58.63 72.15,58.63 ; 34.09,58.63 12.1,58.63 ; 34.09,58.63 34.09,58.64 34.09,62.76 33.95,62.9 ; 81.65,105.81 81.61,105.77 81.55,105.71 81.55,100.35 ; 57.91,39.39 57.92,39.4 57.92,43.83 57.92,43.84 ; 57.91,39.39 77,39.39 ; 262.56,77.44 262.54,77.47 262.54,81.89 262.49,81.95 ; 262.56,77.44 234.31,77.44 ; 267.43,58.63 267.42,58.64 267.42,62.81 267.48,62.88 ; 267.43,58.63 295.77,58.63 ; 200.58,21.21 219.66,21.21 ; 200.58,21.21 200.58,24.77 ; 200.58,21.21 181.48,21.21 ; 219.66,21.21 248.19,21.21 ; 205.48,62.9 205.49,62.89 205.49,58.66 205.47,58.63 ; 214.93,100.33 214.93,105.75 ; 43.61,81.93 43.64,81.89 43.64,77.48 43.68,77.44 ; 139.08,77.44 158.11,77.44 ; 139.08,77.44 119.84,77.44 ; 139.08,77.44 139.1,77.46 139.1,81.92 139.12,81.95 ; 158.11,77.44 157.99,77.56 157.99,81.91 157.96,81.95 ; 158.11,77.44 177.1,77.44 ; 133.98,39.39 134.02,39.43 134.02,43.79 134.04,43.81 ; 133.98,39.39 115,39.39 ; 91.26,58.63 72.15,58.63 ; 91.26,58.63 110.26,58.63 ; 91.26,58.63 91.24,58.64 91.24,62.85 ; 72.15,58.63 72.14,58.64 72.14,62.81 72.1,62.85 ; 124.51,24.72 124.5,24.71 124.5,21.21 ; 162.51,21.21 181.48,21.21 ; 162.51,21.21 162.51,24.73 162.46,24.79 ; 162.51,21.21 143.57,21.21 ; 181.48,21.21 181.48,24.7 181.59,24.81 ; 276.92,21.21 295.95,21.21 ; 276.92,21.21 276.92,24.77 ; 276.92,21.21 248.19,21.21 ; 295.95,21.21 295.95,24.73 295.9,24.77 ; 295.95,21.21 298.46,21.21 299.98,19.68 305.37,19.68 ; 200.69,24.77 200.67,24.79 ; 272.14,100.3 272.14,105.73 ; 272.14,100.3 306.22,100.3 ; 272.14,100.3 272.14,100.29 ; 96.18,39.39 77,39.39 ; 96.18,39.39 115,39.39 ; 215.09,81.9 215.14,81.85 215.14,77.5 215.09,77.44 ; 129.24,100.32 129.24,105.67 129.31,105.74 129.35,105.79 ; 217.26,0.84 217.28,0.85 217.28,5.7 ; 234.31,77.44 215.09,77.44 ; 234.31,77.44 234.35,77.48 234.35,81.86 234.26,81.95 ; 124.5,21.21 143.57,21.21 ; 143.57,21.21 143.57,24.7 143.48,24.8 ; 234,100.35 234,105.71 234.03,105.73 ; 210.21,39.39 229.44,39.39 ; 210.21,39.39 210.22,39.41 210.22,43.82 ; 229.44,39.39 260.25,39.39 ; 229.44,39.39 229.42,39.41 229.42,43.84 ; 306.11,58.63 v3(306.62,59.14) ; 306.11,58.63 306.6,58.14 v3(306.64,58.14) ; 306.11,58.63 295.77,58.63 ; 43.68,77.44 24.53,77.44 ; 305.37,19.68 v3(305.97,19.07) ; 305.37,19.68 v3(305.97,20.29) ; 276.81,0.84 276.81,5.7 ; 77.03,43.86 77.02,43.85 77.02,39.42 77,39.39 ; 295.79,62.81 295.77,62.79 295.77,58.63 ; 238.58,5.73 238.64,5.67 238.64,0.84 ; 115.05,43.85 115.07,43.83 115.07,39.46 115,39.39 ; 295.77,58.63 295.77,58.62 ; 215.09,77.44 196.1,77.44 ; v3(306.79,99.75) 306.78,99.75 306.22,100.3 ; 177.03,81.95 177.1,81.89 177.1,77.44 ; 167.35,58.63 167.34,58.64 167.34,62.84 167.37,62.88 ; 167.35,58.63 148.3,58.63 ; 119.84,77.44 119.84,77.45 119.84,81.8 119.75,81.9 ; 119.84,77.44 100.72,77.44 ; 148.3,58.63 148.29,58.64 148.29,62.73 148.17,62.85 ; 148.3,58.63 129.4,58.63 ; 257.81,0.84 257.81,5.6 257.71,5.7 ; 260.25,39.39 306.23,39.39 ; 260.25,39.39 260.24,39.41 260.24,43.85 ; 306.23,39.39 v3(306.72,39.88) ; 306.22,100.3 v3(306.78,100.86) ; 196.06,81.95 196.04,81.93 196.04,77.5 196.1,77.44 ; 48.22,21.21 18.71,21.21 17.31,22.62 17.31,24.64 17.24,24.71 ; 48.22,21.21 48.22,24.65 48.08,24.79 ; 48.22,21.21 67.25,21.21 ; 110.36,62.85 110.29,62.78 110.29,58.66 110.26,58.63 ; 295.88,5.67 295.98,5.57 295.98,0.84 ; 110.26,58.63 129.4,58.63 ; 31.55,0.84 31.55,5.57 31.42,5.7 ; 67.25,21.21 67.25,24.66 67.16,24.76 ; 100.72,77.44 100.69,77.47 100.69,81.96 ; 12.1,58.63 10.06,60.66 10.06,62.82 10.03,62.85 ; 167.31,100.35 167.31,105.68 167.32,105.69 ; 186.35,100.37 186.35,105.64 186.42,105.71 ; 129.4,58.63 129.39,58.64 129.39,62.89 129.45,62.95 ; 62.58,105.68 62.56,105.67 62.56,100.34 ; 248.19,21.21 248.32,21.34 248.32,24.83 248.27,24.87 ; 295.84,39.39 295.84,43.77 295.88,43.8 ; 177.1,77.44 196.1,77.44 ; 253.05,100.37 253.05,105.75 253.01,105.8 ; 295.94,81.91 295.9,81.86 295.9,77.44 ; 200.58,24.77 200.59,24.78 ; 55.22,5.7 55.33,5.59 55.33,0.84 ; 196.01,0.84 196.01,5.53
  Bottom Layer w0.508: U87.3 71.8,9.59 70.01,7.8 70.01,6.83 ; 278.76,5.73 278.73,5.7 C75.2 ; 40.61,43.83 40.6,43.82 C12.2 ; C32.2 116.8,43.85 116.81,43.83 ; C24.2 88.22,24.82 88.26,24.78 ; C30.2 121.55,81.9 121.59,81.93 ; 191.78,1.6 v5(191.17,2.21) ; 191.78,1.6 v5(192.39,2.21) ; 191.78,1.6 191.78,0.85 191.76,0.84 ; 135.86,43.83 135.84,43.81 C38.2 ; 245.39,62.88 245.38,62.88 C67.2 ; 15.36,24.75 18.71,24.75 18.8,24.67 ; 191.76,0.84 70,0.84 ; 191.76,0.84 306.64,0.84 308.16,2.36 308.16,3 v5(307.57,3.58) ; C63.2 235.87,81.95 235.89,81.93 ; C60.2 221.59,24.76 221.61,24.78 ; 12.06,62.88 12.03,62.85 C3.2 ; C39.2 145.4,24.8 145.41,24.78 ; 231.11,43.83 231.1,43.84 C65.2 ; 188.24,105.76 188.22,105.74 C50.2 ; 102.54,105.76 102.5,105.72 C25.2 ; 70.01,6.83 v5(69.26,6.08) ; 70.01,6.83 v5(70.77,6.07) ; C71.2 273.98,105.76 273.99,105.76 ; 297.81,5.73 297.75,5.67 C82.2 ; 70,0.84 69.2,1.64 v4(69.2,1.65) ; 70,0.84 70.81,1.65 v4(70.82,1.65) ; 70,0.84 9.2,0.84 7.64,2.39 7.64,5.65 7.7,5.7 ; C4.2 14.43,43.85 14.45,43.83 ; C15.2 64.42,81.95 64.44,81.93 ; 159.69,81.93 159.67,81.95 C41.2 ; 178.74,81.93 178.72,81.95 C46.2 ; C37.2 131.02,62.95 131.09,62.88 ; C64.2 226.33,62.88 226.34,62.88 ; C70.2 259.68,5.7 259.71,5.73 ; C42.2 150.1,62.85 150.14,62.88 ; C27.2 92.95,62.85 92.99,62.88 ; C34.2 128.66,5.7 128.7,5.73 ; 59.66,43.83 59.65,43.84 C17.2 ; C11.2 35.82,62.9 35.84,62.88 ; 26.34,81.93 26.31,81.96 C6.2 ; 188.24,62.88 188.23,62.88 C52.2 ; 54.89,62.88 54.87,62.9 C16.2 ; 78.71,43.83 78.69,43.86 C23.2 ; C66.2 254.91,105.79 254.94,105.76 ; v5(308.74,3.58) 308.16,3 ; C29.2 107.3,24.77 107.31,24.78 ; C10.2 45.38,81.93 45.39,81.93 ; C81.2 297.8,24.77 297.81,24.78 ; 269.21,62.88 269.2,62.88 C73.2 ; v5(188.27,4.5) 187.1,5.66 187.1,8.47 186.9,8.68 ; 169.19,105.76 169.17,105.77 C45.2 ; 83.49,105.76 83.47,105.77 C20.2 ; 235.89,105.76 235.87,105.74 C62.2 ; C48.2 173.93,43.8 173.96,43.83 ; C56.2 216.83,105.76 216.84,105.76 ; C14.2 64.43,105.76 64.44,105.76 ; C68.2 262.03,43.85 262.05,43.83 ; 216.84,81.93 216.8,81.9 C57.2 ; v5(206.1,110.67) 206.83,111.39 206.83,112.76 ; 83.49,81.93 83.47,81.91 C21.2 ; 297.81,43.83 297.8,43.85 C79.2 ; 278.76,24.78 278.75,24.77 C74.2 ; 150.14,105.76 150.12,105.74 C40.2 ; C36.2 140.62,81.95 140.64,81.93 ; 197.79,5.73 197.75,5.7 193.98,5.7 ; 193.01,43.83 193,43.82 C53.2 ; C35.2 131.07,105.74 131.09,105.76 ; 207.29,62.88 207.27,62.9 C58.2 ; C77.2 297.8,81.95 297.81,81.93 ; C43.2 154.9,43.82 154.91,43.83 ; 202.56,24.78 202.55,24.77 C54.2 ; 112.04,62.88 112,62.85 C31.2 ; v5(198.51,114.41) 198.51,111.35 199.19,110.67 v5(202.8,110.67) ; C69.2 250.12,24.82 250.16,24.78 ; C51.2 197.77,81.95 197.79,81.93 ; C61.2 219.19,5.7 219.22,5.73 ; 169.19,62.88 169.18,62.88 C47.2 ; 7.29,105.76 7.27,105.74 C1.2 ; C13.2 50.16,24.79 50.16,24.78 ; 126.36,24.78 126.3,24.72 C33.2 ; C44.2 164.46,24.79 164.46,24.78 ; C83.2 236.82,5.73 240.66,5.73 ; 297.81,105.76 297.81,105.76 C76.2 ; C19.2 57.24,5.7 57.27,5.73 ; 73.94,62.88 73.9,62.85 C22.2 ; C28.2 97.75,43.85 97.76,43.83 ; C9.2 45.37,105.77 45.39,105.76 ; C26.2 102.51,81.96 102.54,81.93 ; C8.2 33.41,5.7 33.45,5.73 ; C2.2 7.27,81.95 ; C18.2 69.19,24.76 69.21,24.78 ; USB1.2 202.03,110.79 ; C59.2 212.05,43.82 212.06,43.83 ; 9.67,5.73 9.66,5.72 C5.2 ; 297.76,62.88 297.73,62.85 C78.2 ; 264.44,81.93 264.42,81.95 C72.2 ; 183.51,24.78 183.49,24.81 C49.2 ; v5(188.3,5.99) 187.57,5.26
GND: length 47.1
  Bottom Layer w0.254: 106.24,7.85 v2(106.79,7.85) ; 106.24,7.85 106.28,7.81 U86.44 ; 106.24,7.85 105.67,7.85 104.78,6.95 U86.47 ; U83.28 164.33,18.1 v2(165.06,18.82) 165.83,18.05 U83.31 ; v2(162.48,8.11) 161,8.11 160.75,7.86 ; U86.23 109.28,14.51 v2(109.28,16.69) ; FPC2.3 117,8.56 116.64,8.91 115.63,8.91 v2(115.37,8.66) ; X2.2 98.95,8.3 C97.1 98.95,5.02 v2(98.97,5) ; X2.4 97.58,10.83 C98.1 v2(96.14,12.78) ; 151.58,12.7 C94.1 ; 151.58,12.7 X1.4 ; 151.58,12.7 151.58,12.88 v2(150.17,12.88) ; 160.75,7.86 160.83,7.79 U83.60 ; 160.75,7.86 159.33,6.44 U83.63 ; U83.18 159.33,14.87 v2(159.32,14.86) ; v2(166.68,9.17) 166.68,8.71 167.29,8.1 U83.47 ; v2(104.81,9.83) 103.63,11.01 U86.8 ; v2(109.38,9.12) 110.49,8.01 U86.35 ; v2(107.5,16.43) 107.78,16.16 U86.20 ; v2(153.17,5.16) 153.17,6.69 C93.1 153.18,8.5 X1.2
  vias: v2(4.31,109.61) v2(4.31,99.45) v2(4.31,84.21) v2(4.31,74.05) v2(4.31,68.97) v2(4.31,63.89) v2(4.31,58.81) v2(4.31,53.73) v2(4.31,8.01) v2(4.31,2.93) v2(8.43,114.64) v2(9.44,95.03) v2(9.39,89.29) v2(9.39,74.05) v2(9.39,58.81) v2(9.39,33.41) v2(9.39,28.33) v2(9.39,23.25) v2(9.39,8.01) v2(9.9,65.01) v2(9.95,38.49) v2(10.52,46.15) v2(12.59,38.49) v2(13.15,84.06) v2(14.47,99.45) v2(14.47,95.03) v2(14.47,53.73) v2(14.47,28.33) v2(14.47,8.01) v2(19.55,114.69) v2(19.55,109.61) v2(19.55,104.53) v2(19.55,99.45) v2(19.55,84.21) v2(19.55,48.65) v2(19.55,38.49) v2(19.55,33.41) v2(19.55,8.01) v2(19.6,95.03) v2(20.5,80.14) v2(20.52,78.88) v2(24.63,114.69) v2(24.63,109.61) v2(24.63,104.53) v2(24.63,99.45) v2(24.58,95.03) v2(24.63,84.21) v2(24.63,63.89) v2(24.63,43.57) v2(24.63,38.49) v2(24.58,27.57) v2(27.9,3.62) v2(29.56,24.82) v2(29.71,114.69) v2(29.71,104.53) v2(29.71,99.45) v2(29.71,53.73) v2(29.71,43.57) v2(29.71,38.49) v2(29.71,28.33) v2(29.71,8.01) v2(29.86,95.03) v2(30.51,60.88) v2(32.29,80.44) v2(34.79,114.69) v2(34.79,109.61) v2(34.79,104.53) v2(34.79,99.45) v2(34.79,95.03) v2(34.79,38.49) v2(34.79,33.41) v2(34.79,28.33) v2(34.79,22.79) v2(34.79,13.09) v2(35.06,41.75) v2(39.53,4.24) v2(39.87,109.61) v2(39.87,99.45) v2(39.87,84.21) v2(39.86,80.54) v2(39.87,79.13) v2(39.87,53.73) v2(39.87,38.49) v2(39.87,33.41) v2(39.87,28.33) v2(39.87,8.01) v2(39.92,105.85) v2(39.94,103.71) v2(39.92,95.03) v2(40.02,22.79) v2(40.13,69.02) v2(41.93,61.39) v2(44.61,22.78) v2(44.95,114.69) v2(44.95,109.61) v2(44.95,99.45) v2(44.95,84.21) v2(44.95,63.89) v2(44.95,38.49) v2(44.95,28.33) v2(44.95,8.01) v2(44.95,2.93) v2(45.05,94.98) v2(45.87,12.48) v2(47.8,44.08) v2(47.81,42.29) v2(49.43,60.88) v2(50.03,99.45) v2(50.03,84.21) v2(50.03,38.49) v2(50.03,33.41) v2(50.03,13.09) v2(50.03,8.01) v2(50.13,94.98) v2(50.48,5.35) v2(50.49,3.34) v2(51.34,80.44) v2(51.42,104.27) v2(54.16,43.53) v2(55.11,38.49) v2(55.11,8.01) v2(56.03,79.79) v2(57.09,24.77) v2(57.08,23.29) v2(58.86,79.78) v2(58.92,13.75) v2(58.99,103.65) v2(59.73,68.92) v2(60.14,94.98) v2(60.19,109.61) v2(60.19,99.45) v2(60.19,84.21) v2(60.19,63.89) v2(60.19,38.49) v2(60.19,28.33) v2(60.39,53.12) v2(60.55,22.64) v2(60.74,61.39) v2(63.28,4.24) v2(63.61,24.05) v2(65.27,114.69) v2(65.27,99.45) v2(65.27,89.29) v2(65.27,38.49) v2(65.27,28.33) v2(65.32,94.98) v2(65.75,42.34) v2(66.29,43.82) v2(68.48,60.76) v2(70.36,104.27) v2(70.35,99.45) v2(70.35,94.98) v2(70.35,84.21) v2(70.35,38.49) v2(70.35,33.41) v2(70.52,80.44) v2(72.85,5) v2(73.56,42.47) v2(75.36,23.29) v2(75.43,114.69) v2(75.43,13.09) v2(75.53,79.89) v2(75.48,46.92) v2(78.14,103.76) v2(78.09,79.88) v2(79.34,53.22) v2(80.14,61.39) v2(80.51,114.69) v2(80.51,109.61) v2(80.51,99.45) v2(80.51,94.98) v2(80.51,84.21) v2(80.51,63.89) v2(80.51,38.49) v2(80.51,33.41) v2(80.51,28.33) v2(80.51,13.09) v2(80.61,22.74) v2(82.63,22.75) v2(83.41,4.45) v2(85.54,94.98) v2(85.54,43.67) v2(85.55,42.29) v2(85.59,114.69) v2(85.59,99.45) v2(85.59,89.29) v2(85.59,48.65) v2(85.59,38.49) v2(85.59,28.33) v2(86.71,66.28) v2(87.05,60.88) v2(88.17,4.37) v2(89.44,80.44) v2(89.57,104.27) v2(89.5,33.41) v2(90.67,99.45) v2(90.67,94.98) v2(90.67,84.21) v2(90.67,52.92) v2(90.67,38.49) v2(90.67,13.09) v2(90.77,46.97) v2(91.13,104.28) v2(92.06,43.66) v2(94.33,52.87) v2(94.52,23.29) v2(95.66,10.59) v2(95.65,8.01) v2(95.75,114.69) v2(95.75,109.61) v2(95.75,99.45) v2(95.75,84.21) v2(95.9,94.98) v2(96.01,23.3) v2(96.11,80.96) v2(96.09,79.42) v2(97.02,105.55) v2(97.03,103.71) v2(99.17,61.39) v2(100.43,34.07) v2(100.48,63.23) v2(100.83,114.69) v2(100.83,109.61) v2(100.83,99.45) v2(100.83,84.21) v2(100.83,38.49) v2(100.83,28.33) v2(100.83,8.01) v2(100.88,94.98) v2(101.64,24.42) v2(101.63,23.04) v2(102.22,5.96) v2(104.79,43.82) v2(104.81,42.29) v2(105.91,99.45) v2(105.91,94.98) v2(105.91,38.49) v2(105.91,28.33) v2(106.01,34.07) v2(106.33,60.88) v2(107.35,11.41) v2(108.46,104.27) v2(108.57,80.44) v2(109.72,53.48) v2(110.99,109.61) v2(110.99,104.53) v2(110.99,79.13) v2(110.99,38.49) v2(111.03,4.75) v2(111.09,94.98) v2(111.25,44.08) v2(111.44,42.85) v2(111.72,15.47) v2(113.57,23.29) v2(115.41,23.3) v2(115.53,81.1) v2(115.51,79.13) v2(115.83,15.47) v2(116.07,114.69) v2(116.07,109.61) v2(116.07,104.53) v2(116.07,99.45) v2(116.07,84.21) v2(116.07,53.48) v2(116.07,38.49) v2(116.17,94.98) v2(116.22,69.02) v2(118.14,61.39) v2(120.81,22.91) v2(121.05,94.98) v2(121.15,114.69) v2(121.15,109.61) v2(121.15,99.45) v2(121.15,84.21) v2(121.15,63.89) v2(121.15,38.49) v2(121.15,28.33) v2(123.27,42.34) v2(123.22,3.61) v2(123.23,2.37) v2(124.35,103.77) v2(125.38,60.88) v2(125.89,103.76) v2(126.13,94.98) v2(126.23,109.61) v2(126.23,99.45) v2(126.23,84.21) v2(126.23,38.49) v2(126.23,33.41) v2(126.23,8.57) v2(126.96,15.16) v2(127.72,80.44) v2(130.18,41.73) v2(131.31,114.69) v2(131.31,99.45) v2(131.31,94.98) v2(131.31,13.09) v2(132.43,79.79) v2(132.49,23.29) v2(133.61,24.81) v2(134.78,79.78) v2(135.88,68.97) v2(136.2,5.82) v2(136.18,4.27) v2(136.39,109.61) v2(136.39,99.45) v2(136.39,94.98) v2(136.39,84.21) v2(136.39,53.73) v2(136.39,38.49) v2(137.22,104.27) v2(137.4,61.34) v2(137.66,2.62) v2(137.87,62.92) v2(139.99,22.78) v2(141.32,94.98) v2(141.47,114.59) v2(141.47,99.45) v2(141.47,89.29) v2(141.47,38.49) v2(141.47,33.41) v2(141.47,28.33) v2(141.52,46.31) v2(142.35,42.34) v2(144.63,104.62) v2(144.58,60.85) v2(146.45,94.98) v2(146.55,109.61) v2(146.55,84.21) v2(146.55,33.41) v2(146.55,13.09) v2(146.55,8.01) v2(146.58,80.44) v2(147.28,10.08) v2(149.34,41.82) v2(151.54,23.29) v2(151.63,114.69) v2(151.63,99.45) v2(151.63,53.73) v2(152.9,46.77) v2(153.93,80.53) v2(153.92,79.03) v2(155.61,13) v2(156.12,61.39) v2(156.52,104.27) v2(156.71,99.45) v2(156.76,94.98) v2(156.71,84.21) v2(156.71,63.89) v2(156.71,53.73) v2(156.71,38.49) v2(158.91,22.91) v2(161.74,94.98) v2(161.74,43.87) v2(161.73,42.29) v2(161.79,114.69) v2(161.79,109.61) v2(161.79,99.45) v2(161.79,89.29) v2(161.79,48.65) v2(161.79,38.49) v2(161.79,33.41) v2(161.79,28.33) v2(161.79,23.25) v2(162,103.72) v2(162.5,66.33) v2(163.48,60.88) v2(164.04,103.71) v2(163.99,12.57) v2(164.5,8.1) v2(165.04,94.98) v2(165.67,80.44) v2(166.47,33.41) v2(166.87,114.69) v2(166.87,109.61) v2(166.87,99.45) v2(166.87,53.73) v2(166.87,38.49) v2(167.18,47.53) v2(167.19,4.9) v2(168.56,42.59) v2(170.59,23.29) v2(171.66,8.1) v2(171.85,94.98) v2(171.95,99.45) v2(171.95,84.21) v2(171.95,53.73) v2(171.95,23.3) v2(172.6,80.33) v2(172.61,78.93) v2(175.37,104.27) v2(175.29,61.39) v2(177.03,109.61) v2(177.03,99.45) v2(176.98,94.98) v2(177.03,84.21) v2(177.03,38.49) v2(177.03,33.41) v2(177.03,28.33) v2(177.13,104.28) v2(177.2,6.91) v2(177.34,24.52) v2(177.35,22.78) v2(177.44,63.48) v2(178.16,5) v2(179.1,6.91) v2(180.09,42.34) v2(180.38,114.69) v2(181.96,94.98) v2(182.11,109.61) v2(182.11,104.53) v2(182.11,99.45) v2(182.11,43.57) v2(182.11,38.49) v2(182.11,33.41) v2(182.11,28.33) v2(182.78,60.88) v2(182.84,5) v2(183.09,103.76) v2(184.43,13.12) v2(184.77,80.44) v2(185.82,94.98) v2(186.24,14.96) v2(187.19,114.69) v2(187.19,109.61) v2(187.19,99.45) v2(187.19,43.57) v2(187.73,41.75) v2(187.97,14.96) v2(189.52,23.29) v2(192.16,80.58) v2(192.17,79.03) v2(192.22,94.98) v2(192.27,84.21) v2(192.27,68.97) v2(192.27,53.73) v2(192.27,28.33) v2(194.34,61.39) v2(194.28,2.08) v2(194.47,104.27) v2(195.02,62.92) v2(196.89,24.37) v2(196.88,22.78) v2(197.06,118.03) v2(197.25,94.98) v2(197.35,99.45) v2(197.35,84.21) v2(197.35,38.49) v2(197.35,28.33) v2(197.35,8.01) v2(199.17,42.34) v2(199.19,105.79) v2(199.89,43.82) v2(200.29,106.62) v2(200.87,111.58) v2(201.21,105.8) v2(201.65,60.82) v2(201.77,94.98) v2(202.28,106.62) v2(202.43,84.21) v2(202.43,38.49) v2(202.43,33.41) v2(202.58,8.01) v2(203.87,80.44) v2(204.12,4.24) v2(204.68,117.22) v2(206.46,43.89) v2(207.51,99.45) v2(207.51,84.21) v2(207.51,38.49) v2(207.51,8.01) v2(207.97,27.67) v2(208.02,53.73) v2(208.19,105.84) v2(208.74,101.88) v2(208.83,79.74) v2(208.82,23.29) v2(210.32,107.87) v2(211.27,79.77) v2(211.44,103.71) v2(212.49,94.98) v2(212.59,99.45) v2(212.59,84.21) v2(212.59,68.97) v2(212.59,53.73) v2(212.59,38.49) v2(212.59,28.33) v2(212.59,8.01) v2(212.91,5.4) v2(212.9,2.98) v2(213.72,61.39) v2(214.06,62.82) v2(215.8,22.68) v2(217.67,114.69) v2(217.67,99.45) v2(217.67,89.29) v2(217.67,38.49) v2(217.67,28.33) v2(217.67,8.01) v2(218.22,42.34) v2(220.89,60.88) v2(221.99,94.98) v2(222.75,84.21) v2(222.75,38.49) v2(222.75,33.41) v2(222.82,104.27) v2(222.82,80.44) v2(225.46,4.24) v2(225.84,42.34) v2(227.83,114.69) v2(227.87,23.29) v2(228.7,79.84) v2(230.6,79.87) v2(230.69,103.71) v2(232.15,52.97) v2(232.51,12.53) v2(232.71,94.98) v2(232.86,18.02) v2(232.91,109.61) v2(232.91,99.45) v2(232.91,84.21) v2(232.91,38.49) v2(232.91,33.41) v2(232.91,28.33) v2(232.91,23.25) v2(233.01,63.18) v2(233,61.31) v2(235.13,3.62) v2(235.15,2.17) v2(237.99,114.69) v2(237.99,99.45) v2(237.99,94.98) v2(237.99,89.29) v2(237.99,43.57) v2(237.98,42.29) v2(237.99,38.49) v2(237.99,33.41) v2(237.99,28.33) v2(237.99,18.02) v2(237.99,8.01) v2(239.01,66.23) v2(239.94,60.88) v2(240.02,2.17) v2(241.81,104.27) v2(241.81,80.44) v2(243.07,104.53) v2(243.07,99.45) v2(243.07,94.98) v2(243.07,53.73) v2(243.07,48.65) v2(243.07,43.57) v2(243.07,38.49) v2(243.07,33.41) v2(243.07,28.33) v2(243.07,18.02) v2(243.07,13.09) v2(244.51,24.33) v2(246.79,4.24) v2(248.15,114.69) v2(248.15,109.61) v2(248.15,104.53) v2(248.15,99.45) v2(248.15,94.98) v2(248.15,89.29) v2(248.15,84.21) v2(248.15,79.13) v2(248.15,53.73) v2(248.15,48.65) v2(248.15,43.57) v2(248.15,38.49) v2(248.15,33.41) v2(248.15,28.33) v2(249.69,103.76) v2(253.03,62.82) v2(253.01,61.34) v2(253.23,114.69) v2(253.23,109.61) v2(253.23,99.45) v2(253.23,94.98) v2(253.23,89.29) v2(253.23,84.21) v2(253.23,79.13) v2(253.23,53.73) v2(253.23,48.65) v2(253.23,43.57) v2(253.23,38.49) v2(253.23,17.92) v2(253.23,8.01) v2(253.21,5.15) v2(253.23,2.93) v2(256.51,41.77) v2(256.57,23.29) v2(258.31,99.45) v2(258.31,84.21) v2(258.31,53.73) v2(258.31,38.49) v2(258.31,23.3) v2(258.31,17.92) v2(258.31,8.01) v2(258.51,28.53) v2(258.87,81.62) v2(258.88,79.58) v2(259.07,68.97) v2(259.18,94.98) v2(260.81,104.27) v2(263.39,109.61) v2(263.39,104.53) v2(263.39,99.45) v2(263.39,84.21) v2(263.39,53.73) v2(263.39,38.49) v2(263.39,33.41) v2(263.39,28.33) v2(263.44,17.92) v2(263.49,94.98) v2(263.54,78.67) v2(263.68,60.88) v2(265.84,4.24) v2(268.22,94.98) v2(268.47,109.61) v2(268.47,104.53) v2(268.47,99.45) v2(268.47,38.49) v2(268.47,33.41) v2(268.47,28.33) v2(268.54,43.46) v2(268.73,22.79) v2(268.79,103.76) v2(270.41,80.44) v2(271.06,4.3) v2(273.06,5.51) v2(273.09,24.67) v2(273.08,22.78) v2(273.09,3.08) v2(273.3,94.98) v2(273.55,114.69) v2(273.55,109.61) v2(273.55,99.45) v2(273.55,68.97) v2(273.55,53.73) v2(273.55,48.65) v2(273.55,43.57) v2(273.55,38.49) v2(273.55,28.33) v2(273.55,17.92) v2(273.55,8.01) v2(275.42,61.39) v2(277.46,62.82) v2(278.38,94.98) v2(278.63,99.45) v2(278.63,89.29) v2(278.63,84.21) v2(278.63,53.73) v2(278.63,48.65) v2(278.63,43.57) v2(278.63,38.49) v2(278.63,33.41) v2(278.63,17.97) v2(278.63,8.01) v2(279.91,104.27) v2(283.15,84.06) v2(283.46,94.98) v2(283.71,99.45) v2(283.71,89.29) v2(283.71,68.97) v2(283.71,63.89) v2(283.71,53.73) v2(283.71,43.57) v2(283.71,38.49) v2(283.71,8.01) v2(284.27,27.82) v2(284.22,17.92) v2(284.89,4.24) v2(285.02,23.29) v2(287.22,18.47) v2(287.98,12.38) v2(288.54,94.98) v2(288.79,114.69) v2(288.79,104.53) v2(288.79,99.45) v2(288.79,89.29) v2(288.79,84.21) v2(288.79,68.97) v2(288.79,63.89) v2(288.79,48.65) v2(288.79,38.49) v2(288.79,28.33) v2(288.79,8.01) v2(289.96,3.69) v2(291.76,41.77) v2(291.86,3.69) v2(291.92,22.69) v2(292.23,79.87) v2(292.23,60.88) v2(292.61,103.76) v2(293.62,94.98) v2(293.87,109.61) v2(293.87,99.45) v2(293.87,84.21) v2(293.87,74.05) v2(293.87,53.73) v2(293.87,38.49) v2(293.87,33.41) v2(293.87,28.33) v2(293.87,18.47) v2(293.87,8.01) v2(298.7,94.98) v2(298.95,114.69) v2(298.95,99.45) v2(298.95,89.29) v2(298.95,74.05) v2(298.95,53.73) v2(298.95,38.49) v2(298.95,33.41) v2(298.95,18.47) v2(298.95,13.09) v2(303.84,104.27) v2(303.78,94.98) v2(303.94,61.39) v2(303.94,23.29) v2(303.94,4.24) v2(304.03,99.45) v2(304.03,84.21) v2(304.03,74.05) v2(304.03,63.89) v2(304.03,38.49) v2(304.03,18.47) v2(304.03,8.01) v2(304.08,43.57) v2(304.1,42.34) v2(304.45,81.56)
(no net):
  vias: v1(22.75,7.48) v1(27.96,109.58) v1(29.94,46.59) v1(232.01,7.43) v1(245.68,47.51) v1(284.49,47.51) v1(285.87,85.66) v1(287.23,109.55)
COL1: length 255
  Top Layer w0.254: 25.91,49.07 25.91,20.26 ; 25.91,49.07 25.89,49.1 v2(24.49,49.1) ; 25.91,49.07 25.91,68.2 ; 25.91,20.26 25.94,20.28 v2(28.8,20.28) ; 25.91,20.26 25.91,14.86 v2(22.16,11.1) ; v6(148.78,16.54) 147.33,18 v6(147.33,18.03) ; 25.91,68.2 25.91,71.2 17.94,79.17 17.94,87.34 17.9,87.3 v2(16.92,87.3) ; 25.91,68.2 v2(22.61,68.2) ; 17.94,87.34 v2(17.94,103.39)
  Bottom Layer w0.254: D18.1 17.95,11.1 v2(22.16,11.1) ; v2(17.94,103.39) 17.94,108.72 D1.1 ; v6(147.33,18.03) 69.98,18.03 68.36,19.65 33.95,19.65 33.32,20.28 v2(28.8,20.28) ; 156.79,14.13 155.12,14.13 154.08,15.16 150.16,15.16 v6(148.78,16.54) ; v2(22.61,68.2) 20.29,68.2 D16.1 ; D17.1 22.7,49.1 v2(24.49,49.1) ; D15.1 15.48,87.3 v2(16.92,87.3)
COL2: length 213.3
  Top Layer w0.254: 39.78,19.59 44.05,15.32 v2(44.05,12.52) ; 39.78,19.59 30.03,29.34 30.03,30.21 ; 39.78,19.59 39.82,19.59 v2(40.47,20.24) ; v6(150.09,16.54) 150.09,16.59 v6(148.66,18.02) ; 30.03,30.21 v2(28.96,30.21) ; 30.03,30.21 30.03,35.38 26.63,38.78 26.63,69.73 36.84,79.93 v2(36.84,85.88)
  Bottom Layer w0.254: D21.1 41.73,11.15 42.68,11.15 v2(44.05,12.52) ; 148.66,18.04 v6(148.66,18.02) 148.12,18.57 70.21,18.57 68.54,20.24 v2(40.47,20.24) ; 27.44,30.18 27.46,30.21 v2(28.96,30.21) ; v2(36.84,85.88) 36.84,86.44 35.94,87.33 D19.1 ; 156.85,14.61 155.35,14.61 154.34,15.62 151.02,15.62 v6(150.09,16.54)
COL3: length 207.9
  Top Layer w0.254: 61.16,30.25 v2(60.26,30.25) ; 47.91,68.25 47.91,73.09 55.84,81.01 55.84,87.35 ; 47.91,68.25 47.91,58.95 51.62,55.24 51.62,49.25 ; 47.91,68.25 v2(45.98,68.25) ; 55.84,87.35 v2(55.18,87.35) ; 55.84,87.35 v2(55.84,109.49) ; 51.62,49.25 v2(50.65,49.25) ; 51.62,49.25 51.62,43.81 61.18,34.26 61.18,24.47 64.95,20.7 69.11,20.7 v2(69.53,20.28) ; v6(154.05,16.59) v6(152.62,18.02)
  Bottom Layer w0.254: 44.1,68.28 44.14,68.25 v2(45.98,68.25) ; 156.59,15.1 155.54,15.1 v6(154.05,16.59) ; v2(55.18,87.35) 53.67,87.35 D22.1 ; 58.48,30.18 58.54,30.25 v2(60.26,30.25) ; v6(152.62,18.02) 151.57,19.07 70.73,19.07 v2(69.53,20.28) 69.58,20.28 ; v2(55.84,109.49) 55.84,110.11 54.73,111.21 D2.1 ; v2(50.65,49.25) 48.89,49.25 D24.1
COL4: length 210.8
  Top Layer w0.254: 65.64,68.2 v2(64.62,68.2) ; 65.64,68.2 65.64,59.05 70.57,54.13 70.57,49.25 ; 65.64,68.2 65.64,71.7 74.84,80.9 74.84,87.45 ; 76.62,20.41 76.62,20.39 v6(77.41,19.61) ; 70.57,49.25 70.57,43.66 79.51,34.72 79.51,30.2 ; 70.57,49.25 70.52,49.3 v2(69.75,49.3) ; v2(74.84,108.99) 74.84,87.45 ; 74.84,87.45 74.78,87.4 v2(74.12,87.4) ; v2(66.79,11.08) 66.8,11.08 67.23,11.08 79.51,23.36 79.51,30.2 ; 79.51,30.2 v2(78.8,30.2)
  Bottom Layer w0.254: D27.1 63.17,68.2 v2(64.62,68.2) ; v2(74.12,87.4) 72.69,87.4 D26.1 ; D28.1 67.99,49.3 v2(69.75,49.3) ; 158.83,17.41 157.42,17.41 155.25,19.58 77.43,19.58 v6(77.41,19.61) ; v2(74.84,108.99) 74.84,110.21 73.94,111.11 D3.1 ; v2(78.8,30.2) 77.51,30.2 D29.1 ; 65.53,11.13 65.58,11.08 v2(66.79,11.08)
COL5: length 172.3
  Top Layer w0.254: v2(102.27,20.45) 99.07,23.65 99.07,30.1 ; 89.11,49.2 v2(88.3,49.2) ; 89.11,49.2 89.11,44.12 99.07,34.16 99.07,30.1 ; 89.11,49.2 89.11,54.18 84.44,58.85 84.44,68.2 ; 84.44,68.2 v2(83.67,68.2) ; 84.44,68.2 84.44,71.7 93.78,81.05 93.78,87.35 ; 99.07,30.1 v2(98.31,30.1) ; v2(93.78,109.7) 93.78,87.35 ; 93.78,87.35 v2(93.12,87.35)
  Bottom Layer w0.254: v2(98.3,30.1) 96.61,30.1 D34.1 ; D31.1 91.77,87.35 v2(93.12,87.35) ; v2(93.78,109.7) 93.78,110.26 92.83,111.21 D4.1 ; v2(102.27,20.45) 102.63,20.08 155.47,20.08 157.33,18.21 160.03,18.21 160.33,17.91 160.33,17.22 160.34,17.21 ; D32.1 82.22,68.2 v2(83.67,68.2) ; D33.1 86.99,49.2 v2(88.3,49.2)
